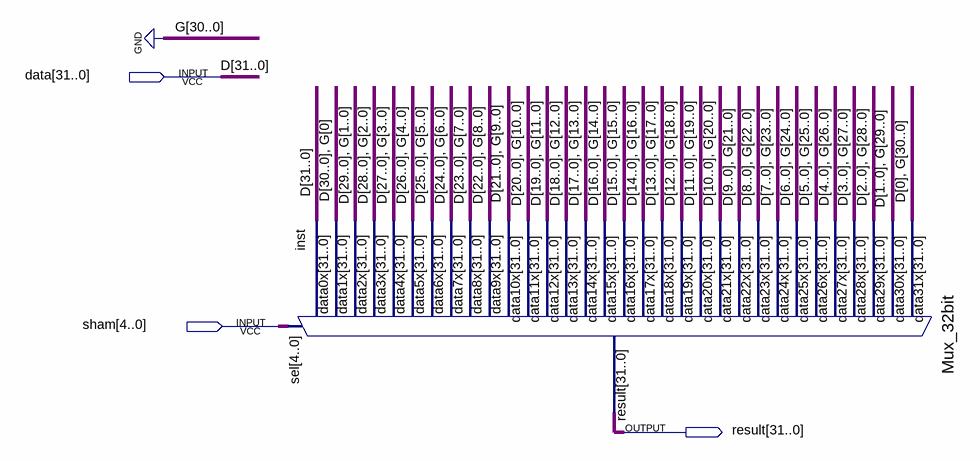
[diagram p0: schematic sheet]
// Quartus schematic left_shift.bdf as structural Verilog: 1 symbols, 3 pins
module left_shift (
  input  [31:0] data,
  input  [4:0] sham,
  output [31:0] result
);

  Mux_32bit inst (
    .data31x({data[0], {31{1'b0}}}), .data30x({data[1:0], {30{1'b0}}}), .data29x({data[2:0], {29{1'b0}}}),
    .data28x({data[3:0], {28{1'b0}}}), .data27x({data[4:0], {27{1'b0}}}), .data26x({data[5:0], {26{1'b0}}}),
    .data25x({data[6:0], {25{1'b0}}}), .data24x({data[7:0], {24{1'b0}}}), .data23x({data[8:0], {23{1'b0}}}),
    .data22x({data[9:0], {22{1'b0}}}), .data21x({data[10:0], {21{1'b0}}}),
    .data20x({data[11:0], {20{1'b0}}}), .data19x({data[12:0], {19{1'b0}}}),
    .data18x({data[13:0], {18{1'b0}}}), .data17x({data[14:0], {17{1'b0}}}),
    .data16x({data[15:0], {16{1'b0}}}), .data15x({data[16:0], {15{1'b0}}}),
    .data14x({data[17:0], {14{1'b0}}}), .data13x({data[18:0], {13{1'b0}}}),
    .data12x({data[19:0], {12{1'b0}}}), .data11x({data[20:0], {11{1'b0}}}),
    .data10x({data[21:0], {10{1'b0}}}), .data9x({data[22:0], {9{1'b0}}}), .data8x({data[23:0], {8{1'b0}}}),
    .data7x({data[24:0], {7{1'b0}}}), .data6x({data[25:0], {6{1'b0}}}), .data5x({data[26:0], {5{1'b0}}}),
    .data4x({data[27:0], 4'b0000}), .data3x({data[28:0], 3'b000}), .data2x({data[29:0], 2'b00}),
    .data1x({data[30:0], 1'b0}), .data0x(data), .sel(sham), .result(result));

  // Other names for the same wires on the sheet: D[31:0] = data
endmodule
